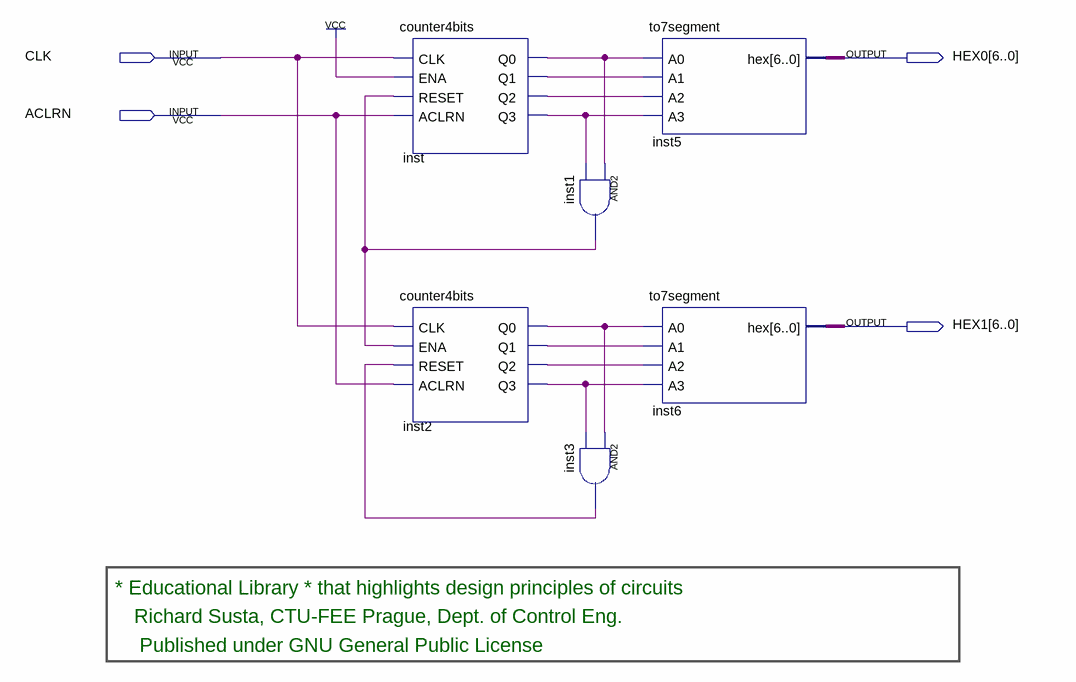
[diagram p0: schematic sheet]
// Quartus schematic counter2BCD.bdf as structural Verilog: 6 symbols, 4 pins
module counter2BCD (
  input  CLK,
  input  ACLRN,
  output [6:0] HEX0,
  output [6:0] HEX1
);

  wire inst1_out, inst2_q0, inst2_q1, inst2_q2, inst2_q3, inst3_out, inst_q0, inst_q1, inst_q2, inst_q3;

  counter4bits inst (
    .CLK(CLK), .ENA(1'b1), .RESET(inst1_out), .ACLRN(ACLRN), .Q0(inst_q0), .Q1(inst_q1), .Q2(inst_q2),
    .Q3(inst_q3));
  counter4bits inst2 (
    .CLK(CLK), .ENA(inst1_out), .RESET(inst3_out), .ACLRN(ACLRN), .Q0(inst2_q0), .Q1(inst2_q1),
    .Q2(inst2_q2), .Q3(inst2_q3));
  and inst1 (inst1_out, inst_q0, inst_q3);
  and inst3 (inst3_out, inst2_q0, inst2_q3);
  to7segment inst5 (.A0(inst_q0), .A1(inst_q1), .A2(inst_q2), .A3(inst_q3), .hex(HEX0));
  to7segment inst6 (.A0(inst2_q0), .A1(inst2_q1), .A2(inst2_q2), .A3(inst2_q3), .hex(HEX1));

  // Notes on the sheet:
  //   * Educational Library * that highlights design principles of circuits
  //   Richard Susta, CTU-FEE Prague, Dept. of Control Eng. 
  //    Published under GNU General Public License
endmodule
